# Altium schematic sheet PowerSupply.SchDoc
size A; SheetNumber: 3
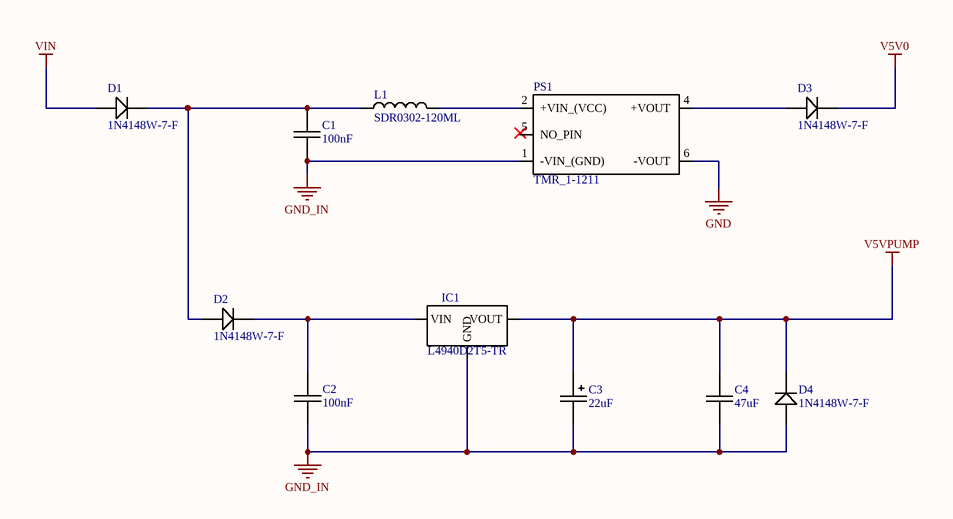
[diagram p0: PowerSupply.SchDoc]

## Parts
C1  100nF  [SMD-CAP_1206_IPC_M]
C2  100nF  [SMD-CAP_1206_IPC_M]
C3  22uF  [CAPPM3216X180N]
C4  47uF  [CAPC3216X180N]
D1  1N4148W-7-F  [SOD3716X115N]
D2  1N4148W-7-F  [SOD3716X115N]
D3  1N4148W-7-F  [SOD3716X115N]
D4  1N4148W-7-F  [SOD3716X115N]
IC1  L4940D2T5-TR  [ST_D2PAK]
L1  SDR0302-120ML  [SDR0302-471KL]
PS1  TMR_1-1211  [TMR-1-1215]

## Nets
GND: PS1.6(-VOUT)
GND_IN: C1.1 C2.1 C3.2 C4.1 D4.2(A) IC1.3(GND) PS1.1(-VIN_(GND))
V5V0: D3.1(K)
V5VPUMP: C3.1 C4.2 D4.1(K) IC1.2(VOUT)
VIN: D1.2(A)
NetC1_2: C1.2 D1.1(K) D2.2(A) L1.1
NetC2_2: C2.2 D2.1(K) IC1.1(VIN)
NetD3_2: D3.2(A) PS1.4(+VOUT)
NetL1_2: L1.2 PS1.2(+VIN_(VCC))

Not connected (* = marked no-connect by the designer): PS1 5(NO_PIN)

## Library data of the parts
C1 C2 = CAP-100NF-1206-5%-25V: Capacitor; Manufacturer_Name: Kemet; Manufacturer_Part_Number: C1206C104J3JACTU; Height: 1mm; Mouser2 Part Number: 80-C1206C104J3J
C3 = CAP-22uF-Tantal-10%-10V: Capacitor Polarised; Manufacturer_Name: AVX; Manufacturer_Part_Number: TPSA226K010T0900; Datasheet Link: https://componentsearchengine.com/Datasheets/1/TPSA226K010T0900.pdf; Height: 1.8mm; Mouser2 Part Number: 581-TPSA226K010T0900
C4 = CAP-47UF-1206-20%-10V: Capacitor; Manufacturer_Name: Kemet; Manufacturer_Part_Number: C1206C476M8PACTU; Datasheet Link: http://componentsearchengine.com/Datasheets/1/C1206C476M8PACTU.pdf; Mouser2 Part Number: 80-C1206C476M8P
D1-D4 = 1N4148W-7-F: Diode; Manufacturer_Name: Diodes Inc.; Datasheet Link: https://componentsearchengine.com/Datasheets/1/1N4148W-7-F.pdf; Height: 1.15mm; Mouser2 Part Number: 621-1N4148W-F; Mouser2 Price/Stock: https://www.mouser.com/Search/Refine.aspx?Keyword=621-1N4148W-F; Manufacturer_Part_Number: 1N4148W-7-F
IC1 = L4940D2T5-TR: Integrated Circuit; Manufacturer_Name: STMicroelectronics; Datasheet Link: https://www.st.com/resource/en/datasheet/l4940.pdf; Manufacturer_Part_Number: L4940D2T5-TR
L1 = SDR0302-120ML: Inductor; Manufacturer_Name: Bourns; Datasheet Link: https://www.bourns.com/docs/Product-Datasheets/SDR0302.pdf; Mouser2 Part Number: 652-SDR0302-120ML; Manufacturer_Part_Number: SDR0302-120ML
PS1 = TMR_1-1211: Power Supply; Manufacturer_Name: Traco Power; Manufacturer_Part_Number: TMR 1-1211; Datasheet Link: https://componentsearchengine.com/Datasheets/1/TMR 1-1211.pdf; Mouser2 Part Number: 495-TMR-1-1211; Mouser2 Price/Stock: https://www.mouser.com/Search/Refine.aspx?Keyword=495-TMR-1-1211